# EAGLE design BTT Manta M5P Julia Daughter Board (EAGLE 9.6.2)
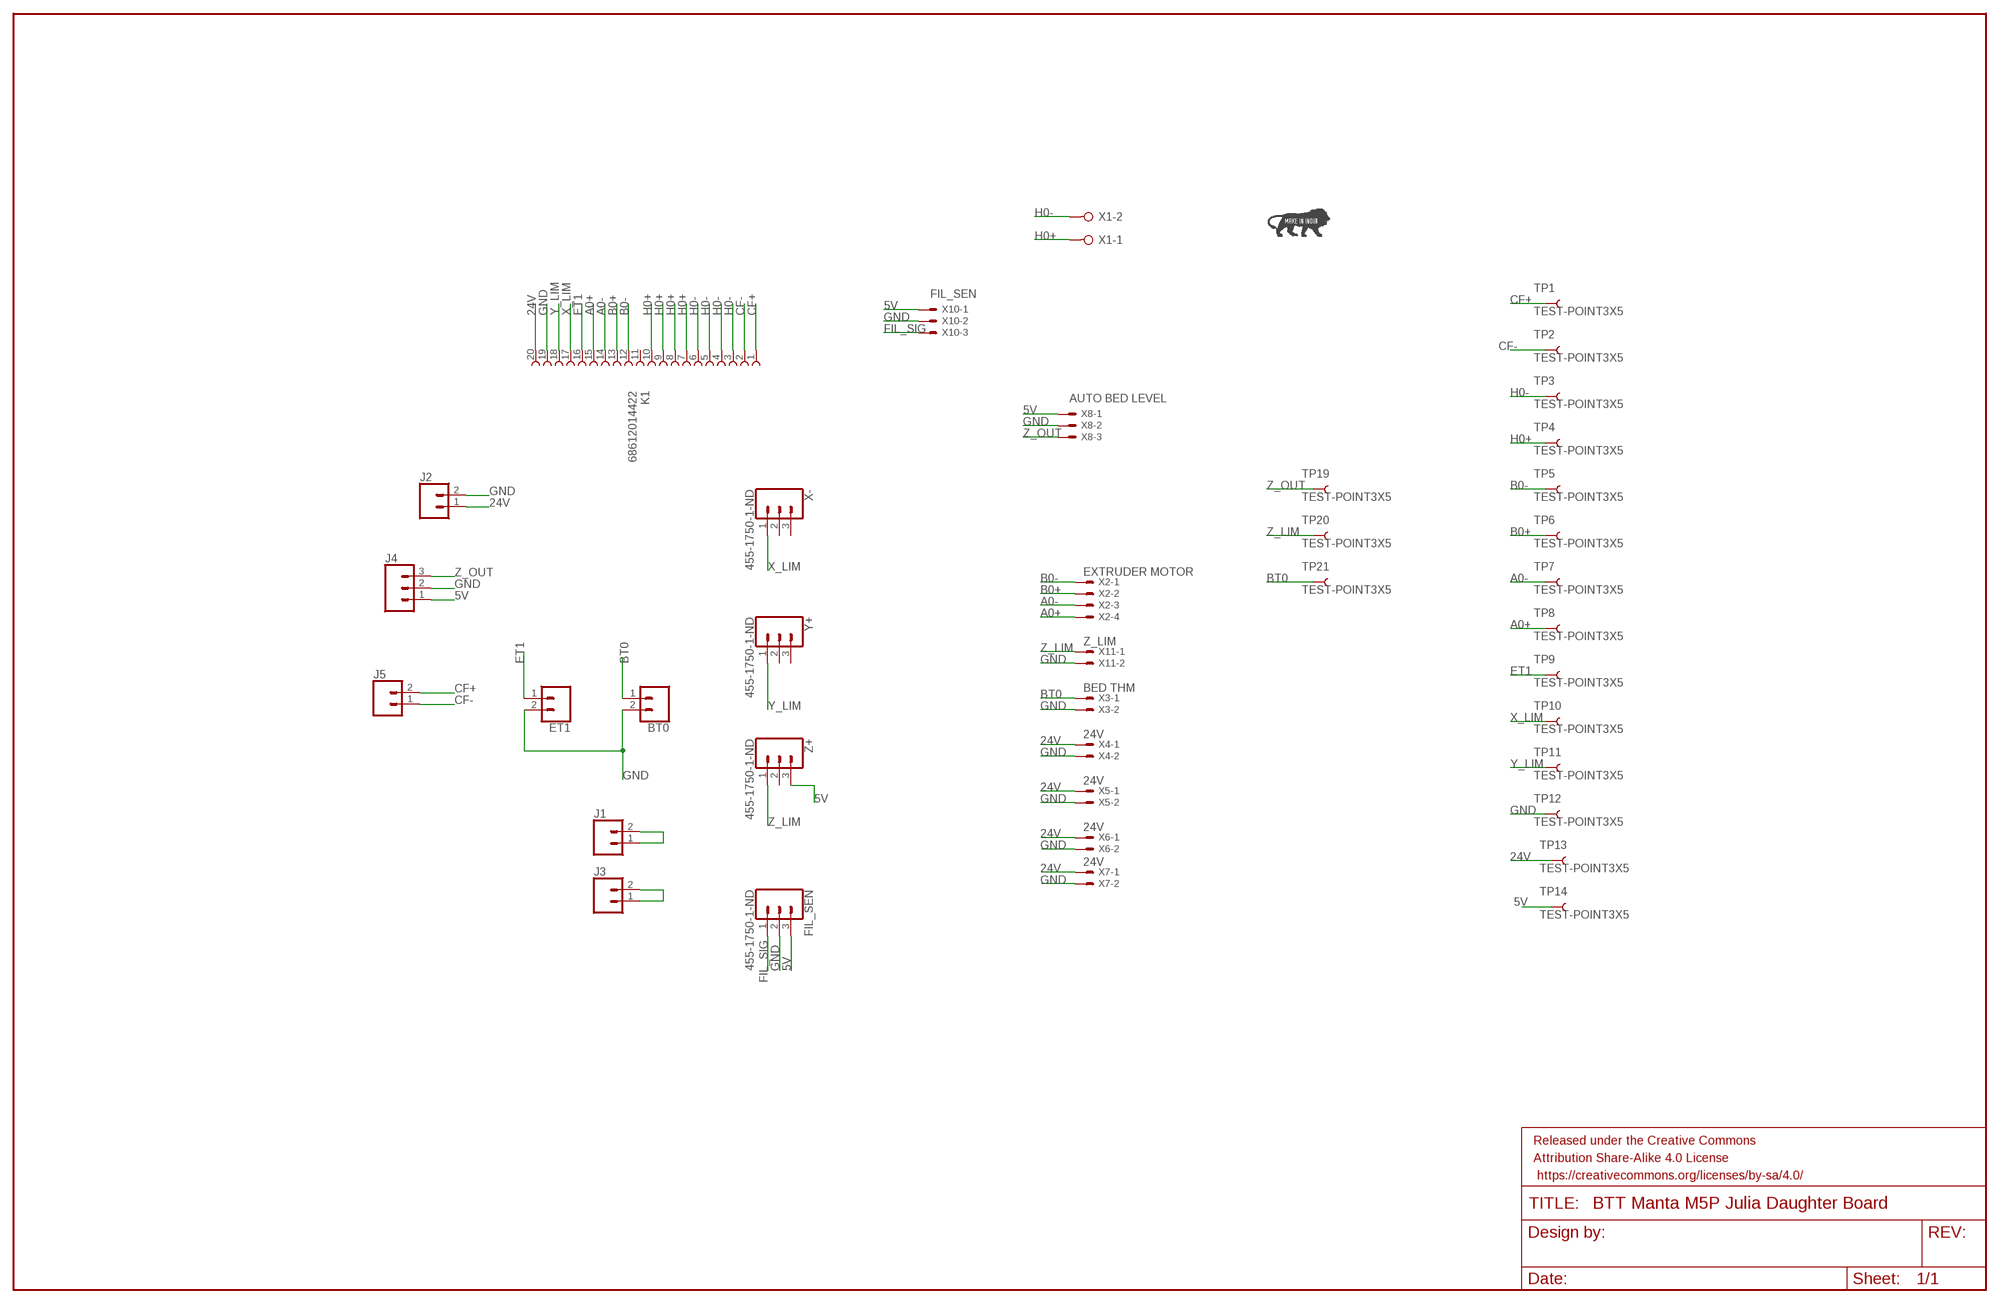
[diagram p0: schematic, sheet 1]

## Parts
BT0  CONN_02  [1X02]
ET1  CONN_02  [1X02]
FIL_SEN  455-1750-1-ND  CONN_03  [1X03]
FRAME1  FRAME-LEDGER  [CREATIVE_COMMONS]
J1  CONN_02  [1X02]
J2  CONN_02  [1X02]
J3  CONN_02  [1X02]
J4  CONN_03  [1X03]
J5  CONN_02  [1X02]
K1  68612014422  [68612014422]
TP1  TEST-POINT3X5  [PAD.03X.05]
TP2  TEST-POINT3X5  [PAD.03X.05]
TP3  TEST-POINT3X5  [PAD.03X.05]
TP4  TEST-POINT3X5  [PAD.03X.05]
TP5  TEST-POINT3X5  [PAD.03X.05]
TP6  TEST-POINT3X5  [PAD.03X.05]
TP7  TEST-POINT3X5  [PAD.03X.05]
TP8  TEST-POINT3X5  [PAD.03X.05]
TP9  TEST-POINT3X5  [PAD.03X.05]
TP10  TEST-POINT3X5  [PAD.03X.05]
TP11  TEST-POINT3X5  [PAD.03X.05]
TP12  TEST-POINT3X5  [PAD.03X.05]
TP13  TEST-POINT3X5  [PAD.03X.05]
TP14  TEST-POINT3X5  [PAD.03X.05]
TP19  TEST-POINT3X5  [PAD.03X.05]
TP20  TEST-POINT3X5  [PAD.03X.05]
TP21  TEST-POINT3X5  [PAD.03X.05]
U$2  MAKEININDIA  [MAKEININDIA]
X1  W237-02P  [W237-132]
X2  EXTRUDER MOTOR  JST-XH-04-PIN-LONG-PAD  [JST-XH-04-PACKAGE-LONG-PAD]
X3  BED THM  JST-XH-02-PIN-LONG-PAD  [JST-XH-02-PACKAGE-LONG-PAD]
X4  24V  JST-XH-02-PIN-LONG-PAD  [JST-XH-02-PACKAGE-LONG-PAD]
X5  24V  JST-XH-02-PIN-LONG-PAD  [JST-XH-02-PACKAGE-LONG-PAD]
X6  24V  JST-XH-02-PIN-LONG-PAD  [JST-XH-02-PACKAGE-LONG-PAD]
X7  24V  JST-XH-02-PIN-LONG-PAD  [JST-XH-02-PACKAGE-LONG-PAD]
X8  JST-XH-03-PIN-LONG-PAD  [JST-XH-03-PACKAGE-LONG-PAD]
X10  JST-XH-03-PIN-LONG-PAD  [JST-XH-03-PACKAGE-LONG-PAD]
X11  Z_LIM  JST-XH-02-PIN-LONG-PAD  [JST-XH-02-PACKAGE-LONG-PAD]
X-  455-1750-1-ND  CONN_03  [1X03]
Y+  455-1750-1-ND  CONN_03  [1X03]
Z+  455-1750-1-ND  CONN_03  [1X03]

## Nets
5V: FIL_SEN.3 J4.1 TP14.P$1 X8.1 X10.1 Z+.3
24V: J2.1 K1.20 TP13.P$1 X4.1 X5.1 X6.1 X7.1
A0+: K1.15 TP8.P$1 X2.4
A0-: K1.14 TP7.P$1 X2.3
B0+: K1.13 TP6.P$1 X2.2
B0-: K1.12 TP5.P$1 X2.1
BT0: BT0.1 TP21.P$1 X3.1
CF+: J5.2 K1.1 TP1.P$1
CF-: J5.1 K1.2 TP2.P$1
ET1: ET1.1 K1.16 TP9.P$1
FIL_SIG: FIL_SEN.1 X10.3
GND: BT0.2 ET1.2 FIL_SEN.2 J2.2 J4.2 K1.19 TP12.P$1 X3.2 X4.2 X5.2 X6.2 X7.2 X8.2 X10.2 X11.2
H0+: K1.7 K1.8 K1.9 K1.10 TP4.P$1 X1.1
H0-: K1.3 K1.4 K1.5 K1.6 TP3.P$1 X1.2
N$2: J1.1 J1.2
N$3: J3.1 J3.2
X_LIM: K1.17 TP10.P$1 X-.1
Y_LIM: K1.18 TP11.P$1 Y+.1
Z_LIM: TP20.P$1 X11.1 Z+.1
Z_OUT: J4.3 TP19.P$1 X8.3
Unconnected: K1.11 X-.2 X-.3 Y+.2 Y+.3 Z+.2

## Library data of the parts
BT0 ET1 J1-J3 J5 = SparkFun-Connectors:CONN_02: Multi connection point. Often used as Generic Header-pin footprint for 0.1 inch spaced/style header connections On any of the 0.1 inch spaced packages, you can populate with these: Break Away Headers - Straight <https://www.sparkfun.com/products/116> (PRT-00116) Break Away Male Headers - Right Angle <https://www.sparkfun.com/products/553> (PRT-00553) Female Headers <https://www.sparkfun.com/products/115> (PRT-00115) Break Away Headers - Machine Pin <https://www.sparkfun.com/products/117> (PRT-00117) Break Away Female Headers - Swiss Machine Pin <https://www.sparkfun.com/products/743> (PRT-00743) For SCREWTERMINALS and SPRING TERMINALS visit here: Screw Terimnals on SparkFun.com <https://www.sparkfun.com/search/results?term=Screw+Terminals> (5mm/3.5mm/2.54mm spacing) This device is also useful as a general connection point to wire up your design to another part of your project. Our various solder wires solder well into these plated through hole pads. Hook-Up Wire - Assortment (Stranded, 22 AWG) <https://www.sparkfun.com/products/11375> (PRT-11375) Hook-Up Wire - Assortment (Solid Core, 22 AWG) <https://www.sparkfun.com/products/11367> (PRT-11367) View the entire wire category on our website here <https://www.sparkfun.com/categories/141> Special notes: Molex polarized connector foot print use with: PRT-08233 with associated crimp pins and housings. 2.54_SCREWTERM for use with PRT-10571. 3.5mm Screw Terminal footprints for PRT-08084 5mm Screw Terminal footprints for use with PRT-08432
FIL_SEN X- Y+ Z+ = SparkFun-Connectors:CONN_03: Multi connection point. Often used as Generic Header-pin footprint for 0.1 inch spaced/style header connections On any of the 0.1 inch spaced packages, you can populate with these: Break Away Headers - Straight <https://www.sparkfun.com/products/116> (PRT-00116) Break Away Male Headers - Right Angle <https://www.sparkfun.com/products/553> (PRT-00553) Female Headers <https://www.sparkfun.com/products/115> (PRT-00115) Break Away Headers - Machine Pin <https://www.sparkfun.com/products/117> (PRT-00117) Break Away Female Headers - Swiss Machine Pin <https://www.sparkfun.com/products/743> (PRT-00743) Stackable Header - 3 Pin (Female, 0.1") <https://www.sparkfun.com/products/13875> (PRT-13875) For SCREWTERMINALS and SPRING TERMINALS visit here: Screw Terimnals on SparkFun.com <https://www.sparkfun.com/search/results?term=Screw+Terminals> (5mm/3.5mm/2.54mm spacing) This device is also useful as a general connection point to wire up your design to another part of your project. Our various solder wires solder well into these plated through hole pads. Hook-Up Wire - Assortment (Stranded, 22 AWG) <https://www.sparkfun.com/products/11375> (PRT-11375) Hook-Up Wire - Assortment (Solid Core, 22 AWG) <https://www.sparkfun.com/products/11367> (PRT-11367) View the entire wire category on our website here <https://www.sparkfun.com/categories/141> Special notes: Molex polarized connector foot print use with SKU : PRT-08232 with associated crimp pins and housings.; PROD_ID: XXX-00000
FRAME1 = SparkFun-Aesthetics:FRAME-LEDGER: Schematic Frame - Ledger Standard 11x14 US Ledger frame
J4 = SparkFun-Connectors:CONN_03: Multi connection point. Often used as Generic Header-pin footprint for 0.1 inch spaced/style header connections On any of the 0.1 inch spaced packages, you can populate with these: Break Away Headers - Straight <https://www.sparkfun.com/products/116> (PRT-00116) Break Away Male Headers - Right Angle <https://www.sparkfun.com/products/553> (PRT-00553) Female Headers <https://www.sparkfun.com/products/115> (PRT-00115) Break Away Headers - Machine Pin <https://www.sparkfun.com/products/117> (PRT-00117) Break Away Female Headers - Swiss Machine Pin <https://www.sparkfun.com/products/743> (PRT-00743) Stackable Header - 3 Pin (Female, 0.1") <https://www.sparkfun.com/products/13875> (PRT-13875) For SCREWTERMINALS and SPRING TERMINALS visit here: Screw Terimnals on SparkFun.com <https://www.sparkfun.com/search/results?term=Screw+Terminals> (5mm/3.5mm/2.54mm spacing) This device is also useful as a general connection point to wire up your design to another part of your project. Our various solder wires solder well into these plated through hole pads. Hook-Up Wire - Assortment (Stranded, 22 AWG) <https://www.sparkfun.com/products/11375> (PRT-11375) Hook-Up Wire - Assortment (Solid Core, 22 AWG) <https://www.sparkfun.com/products/11367> (PRT-11367) View the entire wire category on our website here <https://www.sparkfun.com/categories/141> Special notes: Molex polarized connector foot print use with SKU : PRT-08232 with associated crimp pins and housings.
K1 = Wurth_Elektronik_Electromechanic_FPC_Connectors_&_Flat_Flexible_Cable_rev15b:68612014422: WR-FPC 1.00mm SMT ZIF Horizontal Bottom Contact, 20 Pins=>Code : Con_FPC_ZIF_1.00_68612014422 <http://katalog.we-online.de/media/images/eican/Con_FPC_ZIF_1.00_6861xx14422_pf2.jpg> Details see: http://katalog.we-online.de/en/em/686_1xx_144_22 Created 2014-07-09, Karrer Zheng 2014 (C) Würth Elektronik
TP1-TP14 TP19-TP21 = SparkFun-Connectors:TEST-POINT: SparkFun Test Points Bare copper test points for troubleshooting or In-Circuit-Testing. These are used by our Production team for verifying production board runs using pogo-pins on test beds. SparkFun Products: SparkFun LSM9DS1 Breakout <https://www.sparkfun.com/products/13284> SparkFun PSOC <https://www.sparkfun.com/products/13714> SparkFun Load Cell Amplifier <https://www.sparkfun.com/products/13879>
U$2 = FracktalWorks_Eagle_Library:MAKEININDIA
X1 = con-wago-508:W237-02P: WAGO SREW CLAMP; OC_FARNELL: unknown; OC_NEWARK: unknown
X2 = Rembrandt Electronics - JST XH Connectors v1-0:JST-XH-04-PIN: JST XH Connector 2 Pin Wire to board connector. Pitch: 2,54 mm, (0.100") Number of pins: 4 Created by Rembrandt Electronics www.rembrandtelectronics.com
X3-X7 X11 = Rembrandt Electronics - JST XH Connectors v1-0:JST-XH-02-PIN: JST XH Connector 2 Pin Wire to board connector. Pitch: 2,54 mm, (0.100") Number of pins: 2 Created by Rembrandt Electronics www.rembrandtelectronics.com
X8 = Rembrandt Electronics - JST XH Connectors v1-0:JST-XH-03-PIN: JST XH Connector 2 Pin Wire to board connector. Pitch: 2,54 mm, (0.100") Number of pins: 3 Created by Rembrandt Electronics www.rembrandtelectronics.com; VALUE1: AUTO BED LEVEL
X10 = Rembrandt Electronics - JST XH Connectors v1-0:JST-XH-03-PIN: JST XH Connector 2 Pin Wire to board connector. Pitch: 2,54 mm, (0.100") Number of pins: 3 Created by Rembrandt Electronics www.rembrandtelectronics.com; VALUE1: FIL_SEN

## Net classes
0 default: width 0.406 mm

## Board
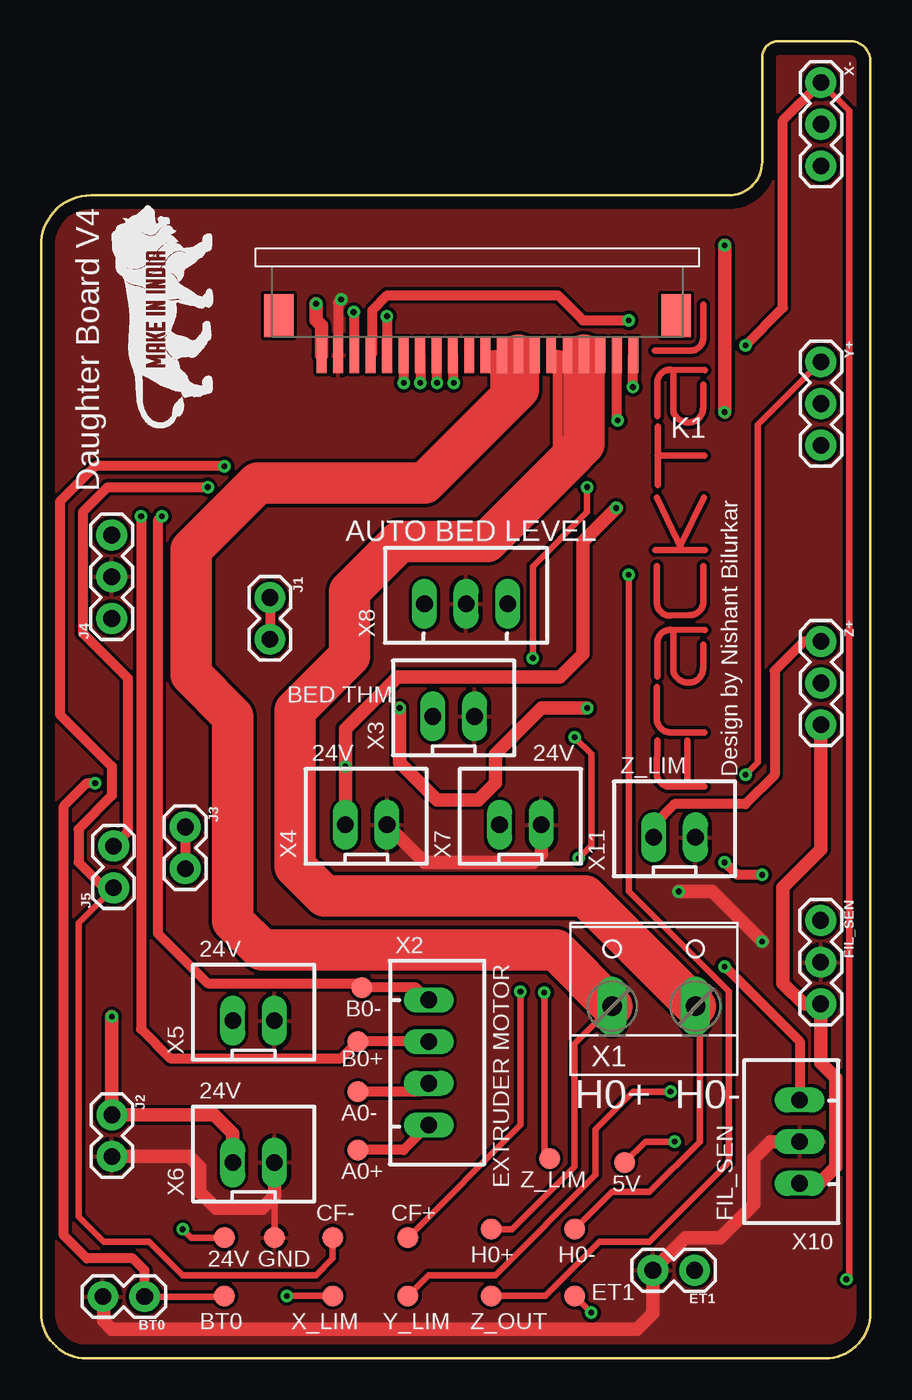
[diagram p1: board, top side]
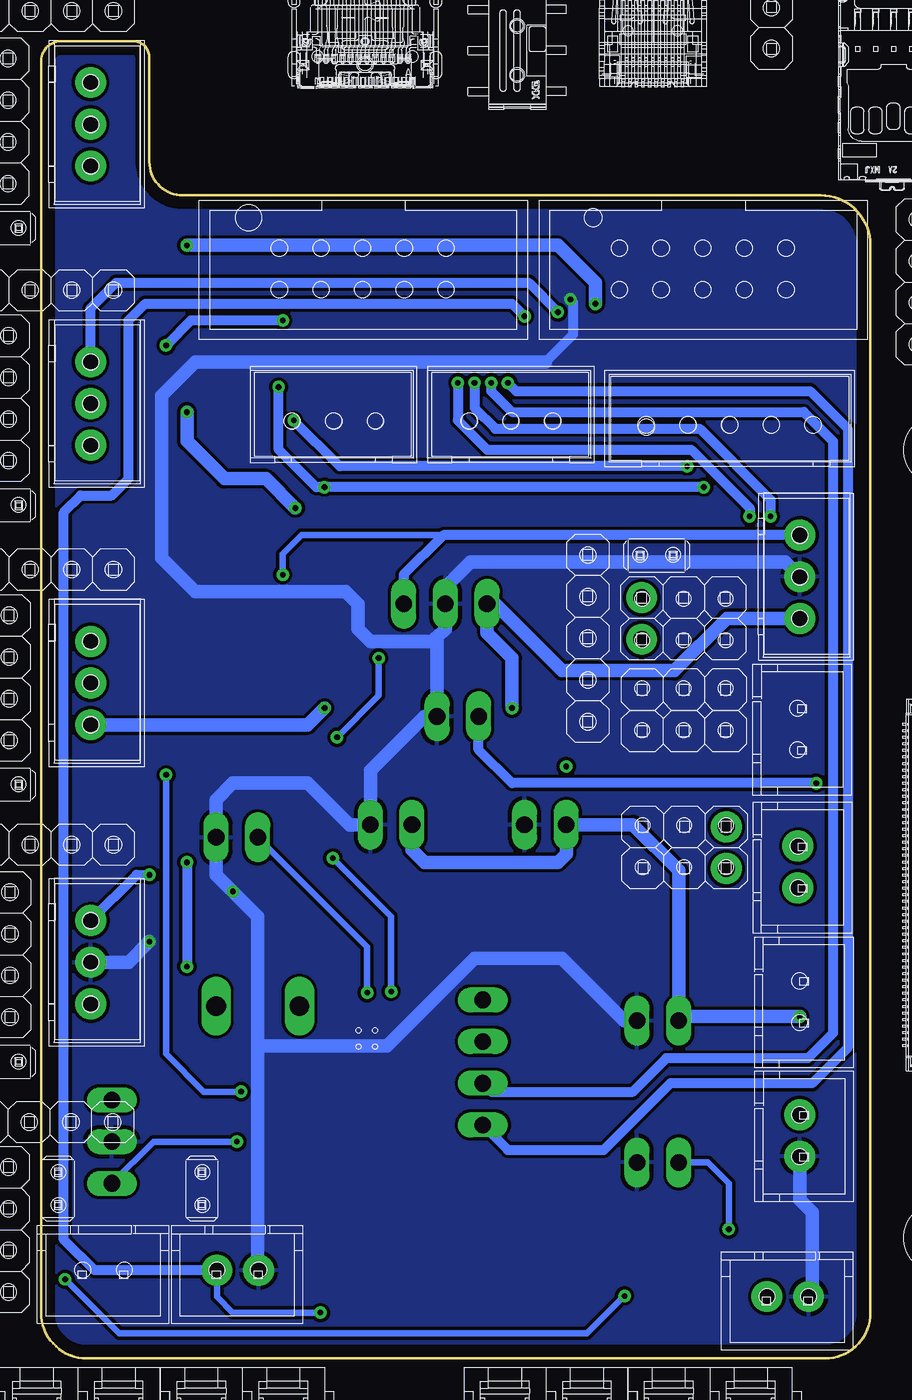
[diagram p2: board, bottom side, seen from below]

Size 50.55 x 80.26 mm. Coordinates in mm from the lower left corner, seen from the top.
Outline: 0,2.79 0,67.82 arc-90 3.05,70.87 41.91,70.87 arc90 43.94,72.9 43.94,79.25 arc-90 44.96,80.26 49.28,80.26 arc-90 50.55,78.99 50.55,2.79 arc-90 47.75,0 2.79,0 arc-90 0,2.79
Copper layers (1*16): Top 0.035mm / dielectric 1.5mm / Bottom 0.035mm
Design rules "LionCircuits": minimum track width 8mil, minimum drill 0.35mm, track to track 8mil, track to pad 8mil, pad to pad 8mil, via to via 8mil, smd to smd 8mil, copper to edge 30mil, drill to drill 10mil, minimum pad ring 10mil, minimum via ring 8mil, stop-mask expansion 4mil, vias tented up to drill 0mil, thermal gap 10mil

### Footprints (pad centres in the part's own frame; a part is rotated, then mirrored left to right if it is on the bottom)
1X02 = drill 1.016 pad 1.88: 1 0,0; 2 2.54,0
1X03 = drill 1.016 pad 1.88: 1 0,0; 2 2.54,0; 3 5.08,0
68612014422 = smd 0.6 x 2.2: 1 -15.77,1.1; 2 -14.77,1.1; 3 -13.77,1.1; 4 -12.77,1.1; 5 -11.77,1.1; 6 -10.77,1.1; 7 -9.77,1.1; 8 -8.77,1.1; 9 -7.77,1.1; 10 -6.77,1.1; 11 -5.77,1.1; 12 -4.77,1.1; 13 -3.77,1.1; 14 -2.77,1.1; 15 -1.77,1.1; 16 -0.77,1.1; 17 0.23,1.1; 18 1.23,1.1; 19 2.23,1.1; 20 3.23,1.1 | smd 1.8 x 2.6: Z1 -18.37,-1.3; Z2 5.83,-1.3
PAD.03X.05 = smd 1.27 x 1.27: P$1 0,0
W237-132 = drill 1.194 long: 1 -2.54,-0.635; 2 2.54,-0.635
JST-XH-04-PACKAGE-LONG-PAD = drill 1.016 long: 1 -3.81,0; 2 -1.27,0; 3 1.27,0; 4 3.81,0
JST-XH-02-PACKAGE-LONG-PAD = drill 1.016 long: 1 -1.27,0; 2 1.27,0
JST-XH-03-PACKAGE-LONG-PAD = drill 1.016 long: 1 -2.54,0; 2 0,0; 3 2.54,0

### Placement (x,y rotation side)
BT0  6.31,3.77 180 top
ET1  39.83,5.38 180 top
FIL_SEN  47.51,26.68 270 top
FRAME1  17.53,-21.08 0 top  (outside the outline)
J1  13.94,46.35 270 top
J2  4.32,14.85 270 top
J3  8.79,32.38 270 top
J4  4.31,45.09 90 top
J5  4.42,28.68 90 top
K1  20.32,62.23 180 top
TP1  22.35,7.37 0 top
TP2  17.78,7.37 0 top
TP3  32.51,7.87 0 top
TP4  27.43,7.87 0 top
TP5  19.56,22.61 0 top
TP6  19.3,19.3 0 top
TP7  19.3,16.26 0 top
TP8  19.3,12.7 0 top
TP9  32.51,3.81 0 top
TP10  17.78,3.81 0 top
TP11  22.35,3.81 0 top
TP12  14.22,7.37 0 top
TP13  11.18,7.37 0 top
TP14  35.56,11.94 0 top
TP19  27.43,3.81 0 top
TP20  30.99,12.19 0 top
TP21  11.18,3.81 0 top
U$1  [FRACKTALLOGO]  40.53,46.84 90 top
U$2  11.18,57.66 90 top
X1  37.34,22.1 0 top
X2  23.62,18.03 270 top
X3  25.15,39.12 0 top
X4  19.81,32.51 0 top
X5  12.95,20.57 0 top
X6  12.95,11.94 0 top
X7  29.21,32.51 0 top
X8  25.91,45.97 0 top
X10  46.23,13.21 90 top
X11  38.61,31.75 0 top
X-  47.52,77.74 270 top
Y+  47.52,60.72 270 top
Z+  47.52,43.69 270 top

### Tracks (layer width: path | path; a pad name or v marks a point on that pad's centre or on a via)
5V  (via drill 0.35)
  Top 0.406: v38.61,13.21 36.83,13.21 TP14.P$1
  Top 0.813: Z+.3 47.52,31.01 45.21,28.7 45.21,22.86 46.47,21.6 FIL_SEN.3 47.51,18.02 48.44,17.09 48.44,11.68 47.42,10.67 X10.1 | v33.27,39.62 30.48,39.62 27.69,36.83 27.69,35.05 26.67,34.04 24.13,34.04 21.84,36.32 v21.84,39.62
  Bottom 0.406: X10.1 43.69,13.21 v38.61,13.21
  Bottom 0.813: J4.1 8.76,45.09 11.94,41.91 18.8,41.91 22.86,45.97 X8.1 23.37,44.2 21.84,42.67 v21.84,39.62 | Z+.3 34.29,38.61 v33.27,39.62
24V  (via drill 0.35)
  Top 0.406: v8.64,7.87 9.14,7.37 TP13.P$1
  Top 0.813: X6.1 11.68,13.72 10.55,14.85 J2.1 v4.32,20.83 | X4.1 v18.54,36.07 18.54,38.35 21.72,41.53 31.62,41.53 33.02,42.93 33.02,49.78 v35.05,51.82 | v41.66,67.82 v41.66,57.66 | v16.76,64.26 16.76,63.25 17.09,62.92 K1.20
  Bottom 0.406: X6.1 9.91,11.94 8.64,10.67 v8.64,7.87
  Bottom 0.813: X7.1 27.94,30.99 27.18,30.23 19.05,30.23 18.54,30.73 X4.1 14.48,32.51 11.68,29.72 X5.1 11.43,20.83 v4.32,20.83 | v16.76,64.26 16.76,65.53 19.05,67.82 v41.66,67.82 | v35.05,51.82 36.83,53.59 39.37,53.59 41.66,55.88 v41.66,57.66
A0+  (via drill 0.35)
  Top 0.61: X2.4 22.1,12.7 TP8.P$1 | K1.15 v22.09,59.44 v22.1,59.44
  Bottom 0.61: v22.1,59.44 21.59,58.93 3.68,58.93 1.4,56.64 1.4,18.92 3.56,16.76 12.19,16.76 16.26,12.7 22.1,12.7 X2.4
A0-  (via drill 0.35)
  Top 0.61: X2.3 23.11,16.26 TP7.P$1 | K1.14 23.11,61.11 v23.11,59.44
  Bottom 0.61: v23.11,59.44 23.11,58.93 21.84,57.66 4.06,57.66 2.29,55.88 2.29,19.81 3.81,18.29 12.45,18.29 14.48,16.26 23.11,16.26 X2.3
B0+  (via drill 0.35)
  Top 0.61: X2.2 TP6.P$1 18.29,18.29 7.87,18.29 6.1,20.07 v6.1,51.31 | K1.13 24.09,59.48 v24.13,59.44
  Bottom 0.61: v24.13,59.44 24.13,57.91 22.86,56.64 10.41,56.64 6.1,52.32 v6.1,51.31
B0-  (via drill 0.35)
  Top 0.61: X2.1 22.86,22.61 TP5.P$1 19.3,22.86 10.16,22.86 7.11,25.91 7.11,51.05 v7.37,51.31 | K1.12 25.09,59.49 v25.15,59.44
  Bottom 0.61: v25.15,59.44 25.15,57.15 23.37,55.37 10.92,55.37 7.37,51.82 v7.37,51.31
BT0  (via drill 0.35)
  Top 0.406: BT0.1 11.14,3.77 TP21.P$1
  Top 0.61: BT0.1 6.31,5.37 5.59,6.1 2.79,6.1 1.4,7.49 1.4,33.66 2.79,35.05 v3.3,35.05
  Bottom 0.61: v3.3,35.05 21.84,35.05 23.88,37.08 X3.1
CF+  (via drill 0.35)
  Top 0.406: v33.27,53.09 33.27,51.56 29.97,48.26 v29.97,42.67 | v32.51,37.85 33.53,36.83 33.53,31.24 v32.77,30.48 | v29.21,22.35 29.21,14.22 TP1.P$1
  Top 0.61: v10.16,53.09 4.06,53.09 2.54,51.56 2.54,44.2 5.28,41.45 5.28,32.08 J5.2 | v36.07,59.18 36.07,61.11 K1.1
  Bottom 0.406: v29.97,42.67 29.97,40.39 v32.51,37.85 | v32.77,30.48 29.21,26.92 v29.21,22.35
  Bottom 0.61: v10.16,53.09 v33.27,53.09 33.78,53.09 36.07,55.37 v36.07,59.18
CF-  (via drill 0.35)
  Top 0.406: TP2.P$1 17.78,6.1 16.76,5.08 8.64,5.08 6.6,7.11 3.81,7.11 2.29,8.64 2.29,26.54 J5.1
  Top 0.61: v11.18,54.36 3.3,54.36 1.14,52.2 1.14,39.24 4.32,36.07 4.32,34.29 2.29,32.26 2.29,30.23 3.83,28.68 J5.1 | v35.15,57.15 35.09,57.2 K1.2
  Bottom 0.61: v11.18,54.36 32.35,54.36 v35.15,57.15
ET1  (via drill 0.35)
  Top 0.406: v33.53,2.79 TP9.P$1
  Top 0.61: v21.08,63.5 v21.09,63.49 K1.16
  Bottom 0.406: ET1.1 39.83,3.76 38.86,2.79 v33.53,2.79
  Bottom 0.61: ET1.1 47.29,5.38 49.15,7.24 49.15,51.56 48.13,52.58 46.23,52.58 45.21,53.59 45.21,63.25 44.2,64.26 21.84,64.26 v21.08,63.5
FIL_SIG  (via drill 0.35)
  Top 0.61: v43.94,29.46 42.42,29.46 v41.66,30.23 | X10.3 46.23,19.3 v41.66,23.88
  Bottom 0.61: FIL_SEN.1 44.73,29.46 v43.94,29.46 | v41.66,30.23 v41.66,23.88
GND  (via drill 0.35)
  Top 0.406: 14.22,9.91 TP12.P$1
  Top 0.61: v18.29,64.52 18.09,64.32 K1.19
  Top 0.813: J2.2 9.03,12.31 9.65,11.68 9.65,10.16 10.67,9.14 13.46,9.14 14.22,9.91 X6.2 | BT0.2 3.81,3.73 3.81,2.29 4.32,1.78 36.32,1.78 37.29,2.74 ET1.2 39.28,7.37 41.4,7.37 43.43,9.4 43.43,12.19 44.45,13.21 X10.2 | X4.2 23.37,30.23 29.97,30.23 30.48,30.73 X7.2 | v43.94,25.4 40.89,28.45 v38.86,28.45
  Bottom 0.61: 19.81,60.71 18.11,62.41 18.11,64.34 v18.29,64.52
  Bottom 0.813: 37.34,19.05 37.34,26.92 v38.86,28.45 39.88,29.46 X11.2 39.88,34.04 38.86,35.05 34.29,35.05 31.75,32.51 X7.2 30.48,35.81 27.18,39.12 X3.2 26.42,43.94 | J2.2 4.32,9.65 3.56,8.89 3.56,3.98 BT0.2 | X5.2 14.99,20.57 18.8,24.38 24.13,24.38 29.46,19.05 37.34,19.05 | J4.2 5.19,48.51 24.38,48.51 25.91,46.99 X8.2 25.91,44.45 26.42,43.94 | ET1.2 37.34,5.43 37.34,19.05 | FIL_SEN.2 45.2,24.14 v43.94,25.4 | 19.81,60.71 41.15,60.71 43.18,58.67 43.18,48.77 41.15,46.74 32,46.74 31.24,45.97 31.24,44.45 30.48,43.69 26.67,43.69 26.42,43.94
  pour Top: 7.87,70.61 41.91,70.61 arc90 44.2,72.9 44.2,74.68 44.2,78.74 arc-90 45.47,80.01 45.97,80.01 49.02,80.01 arc-90 50.29,78.74 50.29,78.49 50.29,3.05 arc-90 47.5,0.25 47.24,0.25 2.54,0.25 arc-90 0.25,2.54 0.25,3.81 0.25,67.82 arc-90 3.05,70.61 3.56,70.61
  pour Bottom: 3.3,70.61 41.91,70.61 arc90 44.2,72.9 44.2,78.49 arc-90 45.72,80.01 48.51,80.01 arc-90 50.29,78.23 50.29,3.05 arc-90 47.5,0.25 3.05,0.25 arc-90 0.25,3.05 0.25,67.56 arc-90
H0+
  Top 0.406: X1.1 32.51,19.18 32.51,11.68 28.7,7.87 TP4.P$1
  Top 0.61: K1.10 27.69,61.13 | 27.69,61.13 K1.9 K1.8 K1.7 | 27.69,57.66 27.69,61.13
  Top 2.54: X1.1 31.37,24.89 13.46,24.89 11.68,26.67 11.68,39.12 9.14,41.66 9.14,49.28 13.21,53.34 23.37,53.34 27.69,57.66 29.09,59.06 K1.8
H0-
  Top 0.406: X1.2 40.13,21.21 40.13,13.21 37.08,10.16 34.8,10.16 TP3.P$1
  Top 0.61: K1.6 31.5,61.13 | 31.5,61.13 K1.5 K1.4 K1.3 | 32.13,54.74 31.5,55.37 31.5,61.13
  Top 2.54: X1.2 33.15,28.19 17.27,28.19 15.49,29.97 15.49,39.49 18.8,42.79 18.8,46.74 21.84,49.78 27.18,49.78 32.13,54.74 33.09,55.7 K1.4
N$2
  Top 0.61: J1.1 J1.2
N$3
  Top 0.61: J3.1 J3.2
X_LIM  (via drill 0.35)
  Top 0.406: X-.1 49.25,76.01 49.25,5 v49.08,4.83 | v14.99,3.81 TP10.P$1
  Top 0.61: K1.17 20.2,61.24 20.2,63.87 21.1,64.77 31.5,64.77 33.02,63.25 v35.81,63.25 | v42.93,61.72 45.21,64.01 45.21,75.44 X-.1
  Bottom 0.406: v49.08,4.83 45.77,1.52 17.27,1.52 v14.99,3.81
  Bottom 0.61: v35.81,63.25 41.4,63.25 v42.93,61.72
Y_LIM  (via drill 0.35)
  Top 0.406: Y+.1 43.69,56.88 43.69,36.32 v42.93,35.56 | v38.35,16.26 36.07,16.26 33.78,13.97 33.78,11.18 27.69,5.08 23.62,5.08 TP11.P$1
  Top 0.61: v19.05,63.75 19.09,63.71 K1.18
  Bottom 0.406: v42.93,35.56 42.93,18.54 40.64,16.26 v38.35,16.26
  Bottom 0.61: Y+.1 47.52,63.98 45.97,65.53 20.83,65.53 v19.05,63.75
Z_LIM  (via drill 0.35)
  Top 0.406: v30.67,22.29 30.67,12.51 TP20.P$1
  Top 0.61: Z+.1 46.48,43.69 44.7,41.91 44.7,35.56 42.93,33.78 38.61,33.78 37.34,32.51 X11.1
  Bottom 0.406: X11.1 30.67,25.08 v30.67,22.29
Z_OUT  (via drill 0.35)
  Top 0.406: v35.81,47.75 35.81,28.45 41.91,22.35 41.91,11.94 37.08,7.11 34.04,7.11 30.73,3.81 TP19.P$1
  Bottom 0.406: 26.04,50.16 34.67,50.16 35.81,49.02 v35.81,47.75
  Bottom 0.61: J4.3 26.04,50.16 28.45,47.75 X8.3

### Text on the board
tNames: Daughter Board V4 | Design by Nishant Bilurkar | B0- | B0+ | H0+ | H0- | A0- | A0+ | Z_LIM | 5V | CF- | CF+ | H0+ | H0- | 24V | GND | ET1 | BT0 | X_LIM | Y_LIM | Z_OUT